# EAGLE design Schema_CFDT (EAGLE 9.6.2)
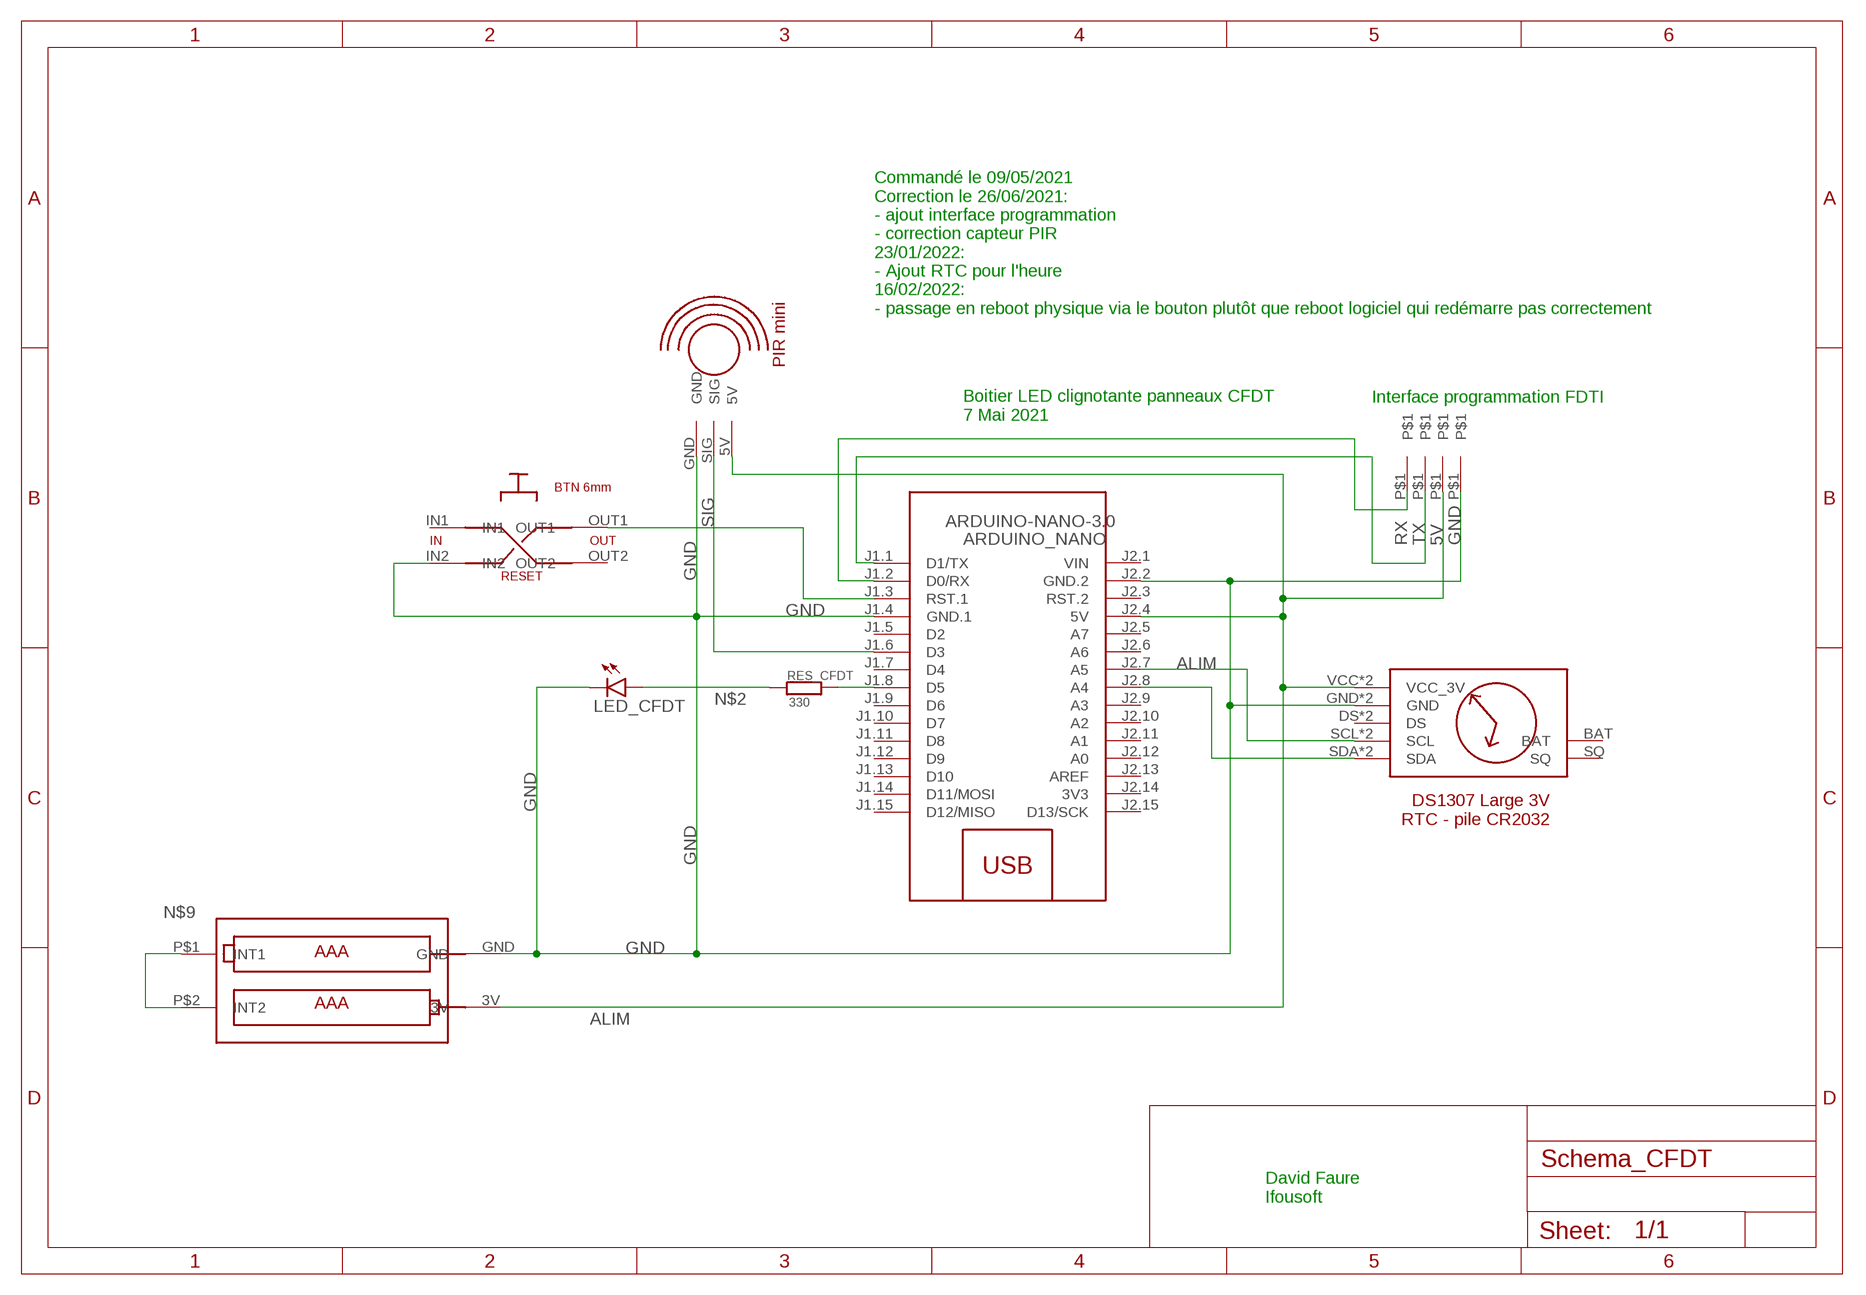
[diagram p0: schematic, sheet 1]

## Parts
5V  IFOU_PIN  [IFOU_PIN]
ARDUINO_NANO  ARDUINO-NANO-3.0  [ARDUINO-NANO-3.0]
GND  IFOU_PIN_GNDIFOU_PIN_GND2  [IFOU_PIN_GND]
LED_CFDT  IFOU_LED3MM  [LED3MM]
RES_CFDT  330  IFOU_RESISTOR  [RESISTOR]
RESET  IFOU_SWITCH_6MM  [IFOU_SWITCH_6MM]
RX  IFOU_PIN  [IFOU_PIN]
TX  IFOU_PIN  [IFOU_PIN]
U$2  IFOU_2XAAA_HOLDER  [IFOU_2XAAA_HOLDER]
U$3  IFOU_MINI_PIR  [IFOU_MINI_PIR]
U$4  IFOU_DS1307_RTC_3V  [IFOU_DS1307_RTC_3V]

## Nets
ALIM: 5V.P$1 ARDUINO_NANO.J2.4(5V) U$2.3V U$3.5V U$4.VCC(VCC_3V) U$4.VCC@2(VCC_3V)
GND: ARDUINO_NANO.J1.4(GND.1) ARDUINO_NANO.J2.2(GND.2) GND.P$1 LED_CFDT.K(C) RESET.IN2 U$2.GND U$3.GND U$4.GND U$4.GND@2(GND)
N$1: ARDUINO_NANO.J1.8(D5) RES_CFDT.PIN2
N$2: LED_CFDT.A RES_CFDT.PIN1
N$3: ARDUINO_NANO.J1.3(RST.1) RESET.OUT1
N$5: ARDUINO_NANO.J2.8(A4) U$4.SDA U$4.SDA@2(SDA)
N$7: ARDUINO_NANO.J2.7(A5) U$4.SCL U$4.SCL@2(SCL)
N$9: U$2.P$1(INT1) U$2.P$2(INT2)
RX: ARDUINO_NANO.J1.2(D0/RX) RX.P$1
SIG: ARDUINO_NANO.J1.6(D3) U$3.SIG
TX: ARDUINO_NANO.J1.1(D1/TX) TX.P$1
Unconnected: ARDUINO_NANO.J1.5(D2) ARDUINO_NANO.J1.7(D4) ARDUINO_NANO.J1.9(D6) ARDUINO_NANO.J1.10(D7) ARDUINO_NANO.J1.11(D8) ARDUINO_NANO.J1.12(D9) ARDUINO_NANO.J1.13(D10) ARDUINO_NANO.J1.14(D11/MOSI) ARDUINO_NANO.J1.15(D12/MISO) ARDUINO_NANO.J2.3(RST.2) ARDUINO_NANO.J2.5(A7) ARDUINO_NANO.J2.6(A6) ARDUINO_NANO.J2.9(A3) ARDUINO_NANO.J2.10(A2) ARDUINO_NANO.J2.11(A1) ARDUINO_NANO.J2.12(A0) ARDUINO_NANO.J2.13(AREF) ARDUINO_NANO.J2.15(D13/SCK) RESET.IN1 RESET.OUT2 U$4.BAT U$4.DS U$4.DS@2(DS) U$4.SQ

## Notes on the sheet
- Commandé le 09/05/2021
  Correction le 26/06/2021:
  - ajout interface programmation
  - correction capteur PIR
  23/01/2022:
  - Ajout RTC pour l'heure
  16/02/2022:
  - passage en reboot physique via le bouton plutôt que reboot logiciel qui redémarre pas correctement
- Interface programmation FDTI
- Boitier LED clignotante panneaux CFDT
  7 Mai 2021
- David Faure
  Ifousoft

## Power pins joined to a net without a drawn wire
3V3: ARDUINO_NANO.J2.14(3V3)
VIN: ARDUINO_NANO.J2.1(VIN)

## Library data of the parts
5V RX TX = Ifou:IFOU_PIN
ARDUINO_NANO = diy-modules:ARDUINO-NANO-3.0: Arduino Nano 3.0 and compatible devices More details available here: https://www.arduino.cc/en/Main/ArduinoBoardNano Click here to find device on ebay.com <http://www.ebay.com/sch/arduino+nano>
GND = Ifou:IFOU_PIN_GND
LED_CFDT = Ifou:IFOU_LED: LED OSRAM: - CHIPLED LG R971, LG N971, LY N971, LG Q971, LY Q971, LO R971, LY R971 LH N974, LH R974 LS Q976, LO Q976, LY Q976 LO Q996 - Hyper CHIPLED LW Q18S LB Q993, LB Q99A, LB R99A - SideLED LS A670, LO A670, LY A670, LG A670, LP A670 LB A673, LV A673, LT A673, LW A673 LH A674 LY A675 LS A676, LA A676, LO A676, LY A676, LW A676 LS A679, LY A679, LG A679 - Hyper Micro SIDELED® LS Y876, LA Y876, LO Y876, LY Y876 LT Y87S - SmartLED LW L88C, LW L88S LB L89C, LB L89S, LG L890 LS L89K, LO L89K, LY L89K LS L896, LA L896, LO L896, LY L896 - TOPLED LS T670, LO T670, LY T670, LG T670, LP T670 LSG T670, LSP T670, LSY T670, LOP T670, LYG T670 LG T671, LOG T671, LSG T671 LB T673, LV T673, LT T673, LW T673 LH T674 LS T676, LA T676, LO T676, LY T676, LB T676, LH T676, LSB T676, LW T676 LB T67C, LV T67C, LT T67C, LS T67K, LO T67K, LY T67K, LW E67C LS E67B, LA E67B, LO E67B, LY E67B, LB E67C, LV E67C, LT E67C LW T67C LS T679, LY T679, LG T679 LS T770, LO T770, LY T770, LG T770, LP T770 LB T773, LV T773, LT T773, LW T773 LH T774 LS E675, LA E675, LY E675, LS T675 LS T776, LA T776, LO T776, LY T776, LB T776 LHGB T686 LT T68C, LB T68C - Hyper Mini TOPLED® LB M676 - Mini TOPLED Santana® LG M470 LS M47K, LO M47K, LY M47K Source: http://www.osram.convergy.de LUXEON: - LUMILED® LXK2-PW12-R00, LXK2-PW12-S00, LXK2-PW14-U00, LXK2-PW14-V00 LXK2-PM12-R00, LXK2-PM12-S00, LXK2-PM14-U00 LXK2-PE12-Q00, LXK2-PE12-R00, LXK2-PE12-S00, LXK2-PE14-T00, LXK2-PE14-U00 LXK2-PB12-K00, LXK2-PB12-L00, LXK2-PB12-M00, LXK2-PB14-N00, LXK2-PB14-P00, LXK2-PB14-Q00 LXK2-PR12-L00, LXK2-PR12-M00, LXK2-PR14-Q00, LXK2-PR14-R00 LXK2-PD12-Q00, LXK2-PD12-R00, LXK2-PD12-S00 LXK2-PH12-R00, LXK2-PH12-S00 LXK2-PL12-P00, LXK2-PL12-Q00, LXK2-PL12-R00 Source: www.luxeon.com KINGBRIGHT: KA-3528ASYC Source: www.kingbright.com
RES_CFDT = Ifou:IFOU_RESISTOR
RESET = Ifou:IFOU_SWITCH_6MM
U$2 = Ifou:IFOU_2XAAA_HOLDER
U$3 = Ifou:IFOU_MINI_PIR
U$4 = Ifou:IFOU_DS1307_RTC_3V

## Board
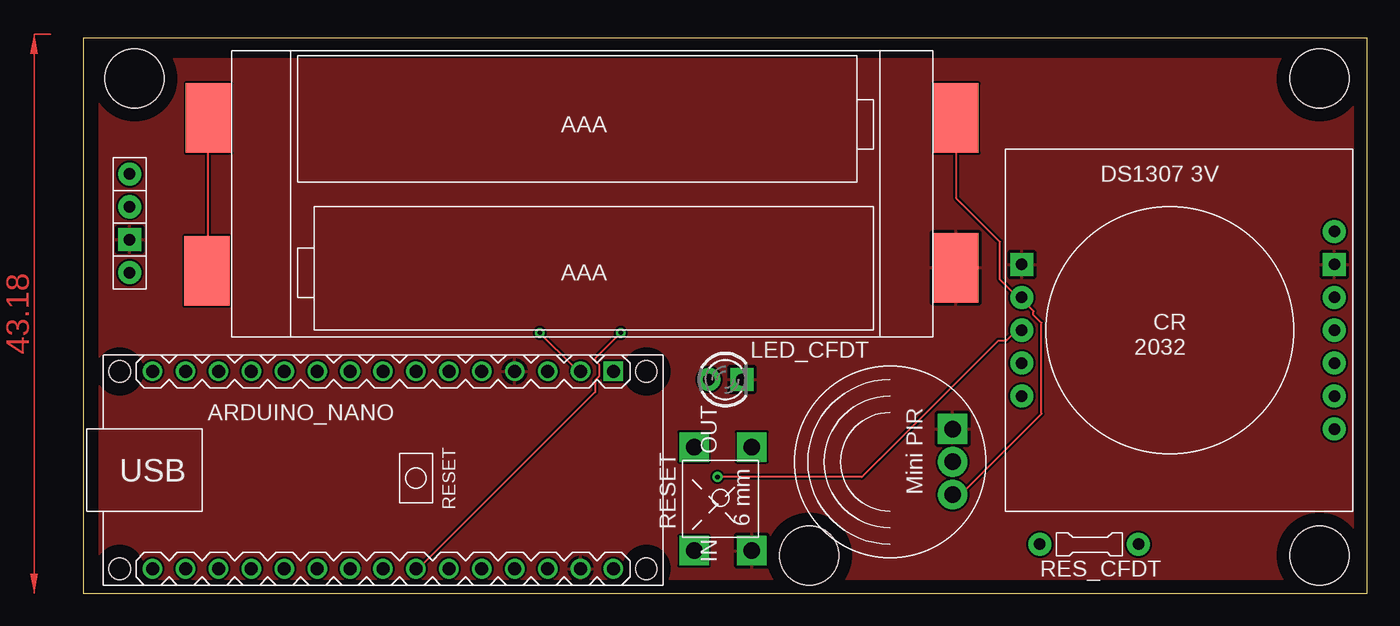
[diagram p1: board, top side]
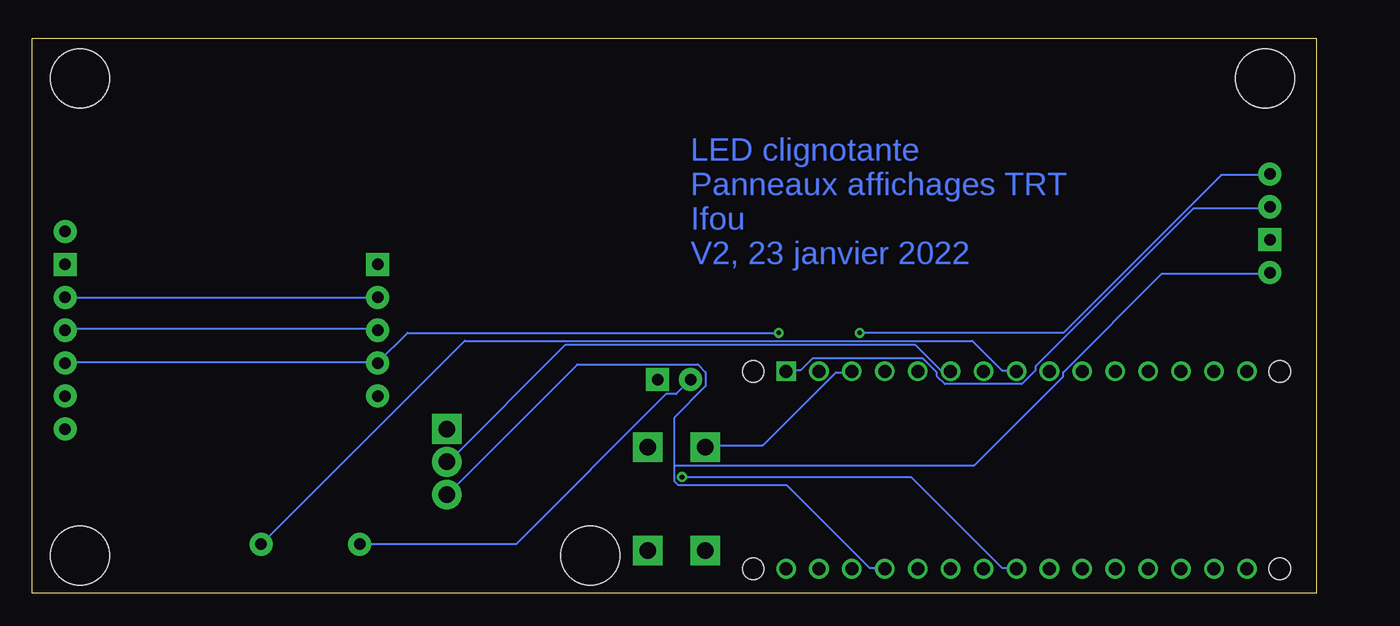
[diagram p2: board, bottom side, seen from below]

Size 99.04 x 42.85 mm. Coordinates in mm from the lower left corner, seen from the top.
Outline: 0,0 99.04,0 99.04,42.85 0,42.85 0,0
Copper layers (1*16): Top 0.035mm / dielectric 1.5mm / Bottom 0.035mm
Design rules "default": minimum track width 6mil, minimum drill 0.35mm, track to track 6mil, track to pad 6mil, pad to pad 6mil, via to via 6mil, smd to smd 6mil, copper to edge 40mil, drill to drill 6mil, minimum pad ring 10mil, minimum via ring 8mil, stop-mask expansion 4mil, vias tented up to drill 0mil, thermal gap 10mil
Holes 4.57 mm at 3.94,39.75 95.38,39.75 95.38,2.92 56.01,2.92

### Footprints (pad centres in the part's own frame; a part is rotated, then mirrored left to right if it is on the bottom)
IFOU_PIN = drill 0.889 pad 1.778: P$1 0,0
ARDUINO-NANO-3.0 = drill 1 square: J1.1 17.78,7.62 | drill 1: J1.2 15.24,7.62; J1.3 12.7,7.62; J1.4 10.16,7.62; J1.5 7.62,7.62; J1.6 5.08,7.62; J1.7 2.54,7.62; J1.8 0,7.62; J1.9 -2.54,7.62; J1.10 -5.08,7.62; J1.11 -7.62,7.62; J1.12 -10.16,7.62; J1.13 -12.7,7.62; J1.14 -15.24,7.62; J1.15 -17.78,7.62; J2.1 17.78,-7.62; J2.2 15.24,-7.62; J2.3 12.7,-7.62; J2.4 10.16,-7.62; J2.5 7.62,-7.62; J2.6 5.08,-7.62; J2.7 2.54,-7.62; J2.8 0,-7.62; J2.9 -2.54,-7.62; J2.10 -5.08,-7.62; J2.11 -7.62,-7.62; J2.12 -10.16,-7.62; J2.13 -12.7,-7.62; J2.14 -15.24,-7.62; J2.15 -17.78,-7.62 | hole 1.651: -20.32,7.62; -20.32,-7.62; 20.32,-7.62; 20.32,7.62
IFOU_PIN_GND = drill 0.889 pad 1.778 square: P$1 0,0
LED3MM = drill 0.889 pad 1.778: A -1.27,0 | drill 0.889 pad 1.778 square: K 1.27,0
RESISTOR = drill 0.889 pad 1.778: PIN1 -2.54,0; PIN2 5.08,0
IFOU_SWITCH_6MM = drill 1.27 pad 2.286 square: IN1 -2.921,6.223; IN2 -2.921,1.778; OUT1 5.08,6.223; OUT2 5.08,1.778
IFOU_2XAAA_HOLDER = smd 3.505 x 5.359: 3V 27.94,7.493; GND 27.94,-4.064; P$1 -29.845,-4.318; P$2 -29.718,7.493
IFOU_MINI_PIR = drill 1.27 pad 2.286: 5V -2.54,-4.826; SIG 0,-4.826 | drill 1.27 pad 2.286 square: GND 2.54,-4.826
IFOU_DS1307_RTC_3V = drill 0.889 pad 1.778: BAT -10.16,-11.43; DS 13.97,1.27; DS@2 -10.16,1.27; SCL 13.97,-1.27; SCL@2 -10.16,-1.27; SDA 13.97,-3.81; SDA@2 -10.16,-3.81; SQ -10.16,3.81; VCC 13.97,-6.35; VCC@2 -10.16,-6.35 | drill 0.889 pad 1.778 square: GND 13.97,-8.89; GND@2 -10.16,-8.89

### Placement (x,y rotation side)
5V  3.56,24.77 180 top
ARDUINO_NANO  23.11,9.53 0 top
GND  3.56,27.3 180 top
LED_CFDT  49.53,16.51 0 top
RES_CFDT  76.33,3.81 0 top
RESET  53.34,6.22 90 top
RX  3.56,32.38 180 top
TX  3.56,29.84 0 top
U$2  39.37,29.21 0 top
U$3  62.23,10.16 90 top
U$4  86.36,16.51 180 top

### Tracks (layer width: path | path; a pad name or v marks a point on that pad's centre or on a via)
ALIM
  Top 0.152: U$2.3V 67.36,36.58 67.36,30.48 70.71,27.13 70.71,24.23 72.08,22.86 U$4.VCC 72.85,22.4 72.85,22.25 73.3,21.79 73.3,21.49 73.91,20.88 73.91,13.87 67.67,7.62 U$3.5V
  Bottom 0.152: U$4.VCC@2 U$4.VCC | 49.53,9.91 49.53,13.56 47.09,16 47.09,17.07 47.7,17.68 57,17.68 U$3.5V | 49.53,9.91 49.53,8.69 49.23,8.38 40.84,8.38 34.44,1.98 33.38,1.98 ARDUINO_NANO.J2.4 | 49.53,9.91 26.36,9.91 19.51,16.76 19.51,17.07 11.89,24.69 3.66,24.69 5V.P$1
GND
  pour Top: 1.27,41.27 98.55,41.27 98.55,0.38 1.27,0.38
N$1
  Bottom 0.152: ARDUINO_NANO.J1.8 23.16,17.22 24.23,17.22 26.52,19.51 65.68,19.51 81.38,3.81 RES_CFDT.PIN2
N$2
  Bottom 0.152: RES_CFDT.PIN1 61.72,3.81 50.14,15.39 49.38,15.39 LED_CFDT.A
N$3
  Bottom 0.152: ARDUINO_NANO.J1.3 35.81,17.07 37.03,17.07 42.67,11.43 47.09,11.43 RESET.OUT1
N$5  (via drill 0.35)
  Top 0.152: v48.92,8.99 60.05,8.99 70.56,19.51 71.17,19.51 71.93,20.27 72.39,20.27 U$4.SDA
  Bottom 0.152: v48.92,8.99 31.24,8.99 24.23,1.98 23.16,1.98 ARDUINO_NANO.J2.8 | U$4.SDA@2 96.47,20.42 72.39,20.42 U$4.SDA
N$7  (via drill 0.35)
  Top 0.152: v41.45,20.12 39.47,18.14 39.47,17.98 39.78,17.68 39.78,16.76 39.47,16.46 39.47,15.54 26.21,2.29 26.06,2.29 25.76,1.98 ARDUINO_NANO.J2.7
  Bottom 0.152: v41.45,20.12 70.1,20.12 72.39,17.83 | 72.39,17.83 96.47,17.83 U$4.SCL@2 | 72.39,17.83 U$4.SCL
N$9
  Top 0.152: U$2.P$1 9.6,24.99 9.6,36.58 U$2.P$2
RX  (via drill 0.35)
  Top 0.152: v35.2,20.12 37.8,17.53 37.95,17.53 38.25,17.22 ARDUINO_NANO.J1.2
  Bottom 0.152: v35.2,20.12 19.51,20.12 7.32,32.31 3.66,32.31 RX.P$1
SIG
  Bottom 0.152: ARDUINO_NANO.J1.6 28.19,17.22 28.96,17.22 30.94,19.2 57.91,19.2 67.06,10.06 U$3.SIG
TX
  Bottom 0.152: ARDUINO_NANO.J1.1 40.84,17.22 39.78,17.22 38.86,18.14 30.33,18.14 29.26,17.07 29.26,16.76 28.65,16.15 22.71,16.15 21.64,17.22 21.64,17.53 9.45,29.72 3.66,29.72 TX.P$1
(copper drawn outside any net)
  shapes: Top area x2

### Text on the board
Bottom: LED clignotante / Panneaux affichages TRT / Ifou / V2, 23 janvier 2022